# EAGLE design MSP430F2272IDA breakout (EAGLE 5.06)
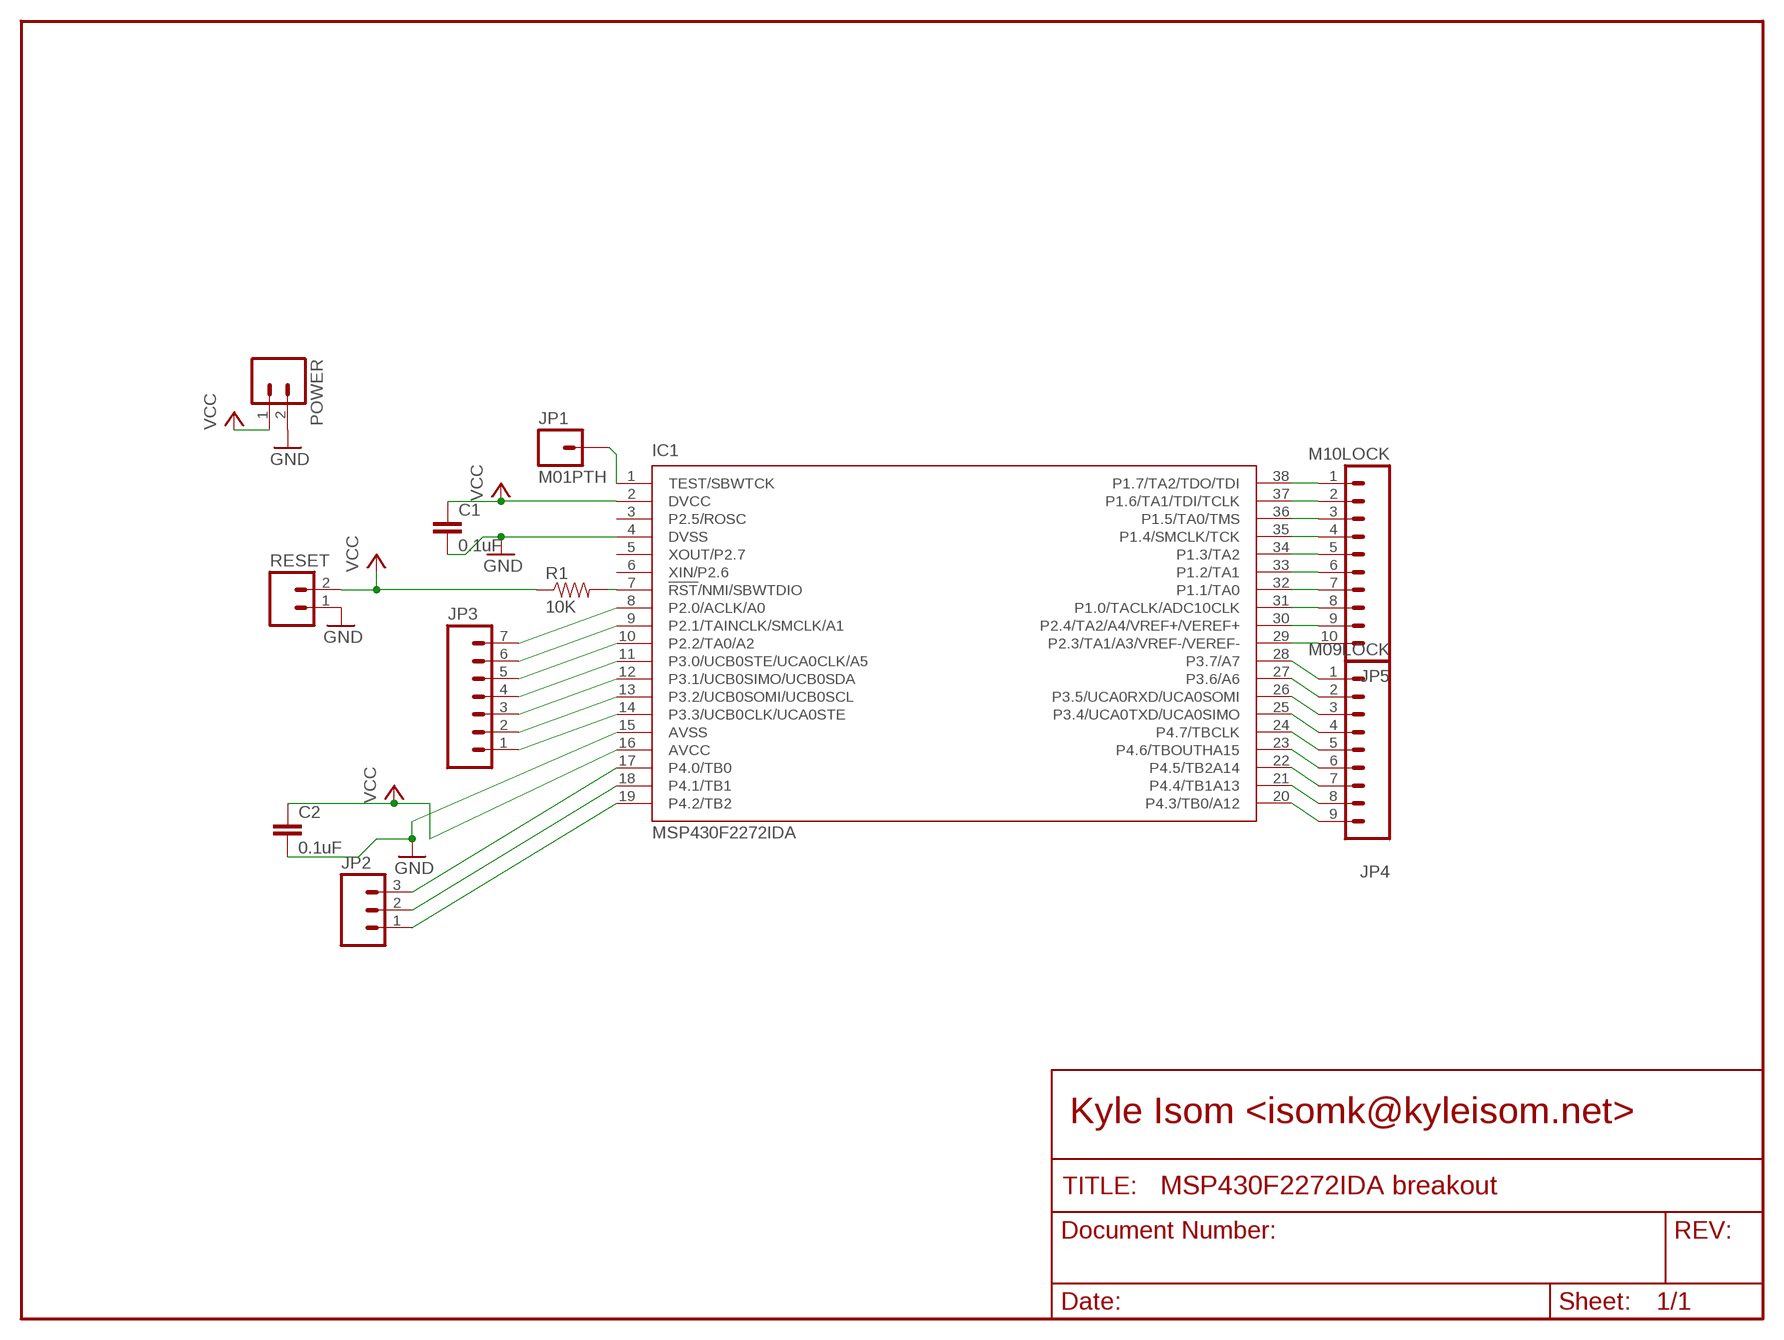
[diagram p0: schematic, sheet 1]

## Parts
C1  0.1uF  CAPPTH1  [CAP-PTH-5MM]
C2  0.1uF  CAPPTH1  [CAP-PTH-5MM]
IC1  MSP430F2272IDA  [TSSOP38_R-PDSO-G38-DA]
JP1  M01PTH  [1X01]
JP2  M03LOCK  [1X03_LOCK]
JP3  M07LOCK  [1X07_LOCK]
JP4  M09LOCK  [1X09_LOCK]
JP5  M10LOCK  [1X10_LOCK]
POWER  M02LOCK  [1X02_LOCK]
R1  10K  RESISTORPTH1  [AXIAL-0.3]
RESET  M02LOCK  [1X02_LOCK]

## Nets
GND: C1.2 C2.2 IC1.4(DVSS) IC1.15(AVSS) POWER.2 RESET.1
N$1: IC1.19(P4.2/TB2) JP2.1
N$2: IC1.18(P4.1/TB1) JP2.2
N$3: IC1.17(P4.0/TB0) JP2.3
N$4: IC1.7(!RST!/NMI/SBWTDIO) R1.P$2
N$5: IC1.14(P3.3/UCB0CLK/UCA0STE) JP3.1
N$6: IC1.13(P3.2/UCB0SOMI/UCB0SCL) JP3.2
N$7: IC1.12(P3.1/UCB0SIMO/UCB0SDA) JP3.3
N$8: IC1.11(P3.0/UCB0STE/UCA0CLK/A5) JP3.4
N$9: IC1.10(P2.2/TA0/A2) JP3.5
N$10: IC1.9(P2.1/TAINCLK/SMCLK/A1) JP3.6
N$11: IC1.8(P2.0/ACLK/A0) JP3.7
N$12: IC1.28(P3.7/A7) JP4.1
N$13: IC1.27(P3.6/A6) JP4.2
N$14: IC1.26(P3.5/UCA0RXD/UCA0SOMI) JP4.3
N$15: IC1.25(P3.4/UCA0TXD/UCA0SIMO) JP4.4
N$16: IC1.24(P4.7/TBCLK) JP4.5
N$17: IC1.23(P4.6/TBOUTHA15) JP4.6
N$18: IC1.22(P4.5/TB2A14) JP4.7
N$19: IC1.21(P4.4/TB1A13) JP4.8
N$20: IC1.20(P4.3/TB0/A12) JP4.9
N$21: IC1.38(P1.7/TA2/TDO/TDI) JP5.1
N$22: IC1.37(P1.6/TA1/TDI/TCLK) JP5.2
N$23: IC1.36(P1.5/TA0/TMS) JP5.3
N$24: IC1.35(P1.4/SMCLK/TCK) JP5.4
N$25: IC1.34(P1.3/TA2) JP5.5
N$26: IC1.33(P1.2/TA1) JP5.6
N$27: IC1.32(P1.1/TA0) JP5.7
N$28: IC1.31(P1.0/TACLK/ADC10CLK) JP5.8
N$29: IC1.30(P2.4/TA2/A4/VREF+/VEREF+) JP5.9
N$30: IC1.29(P2.3/TA1/A3/VREF-/VEREF-) JP5.10
N$31: IC1.1(TEST/SBWTCK) JP1.1
VCC: C1.1 C2.1 IC1.2(DVCC) IC1.16(AVCC) POWER.1 R1.P$1 RESET.2
Unconnected: IC1.3(P2.5/ROSC) IC1.5(XOUT/P2.7) IC1.6(XIN/P2.6)

## Notes on the sheet
- Kyle Isom <isomk@kyleisom.net>

## Library data of the parts
C1 C2 = SparkFun:CAP: Capacitor Standard 0603 ceramic capacitor, and 0.1" leaded capacitor.
IC1 = texas:MSP430F22*2IDA: MIXED SIGNAL MICROCONTROLLER Source: http://focus.ti.com/lit/ds/symlink/msp430f2274.pdf
JP1 = SparkFun:M01: Header 1 Standard 1-pin 0.1" header. Use with straight break away headers (SKU : PRT-00116), right angle break away headers (PRT-00553), swiss pins (PRT-00743), machine pins (PRT-00117), and female headers (PRT-00115).
JP2 = SparkFun:M03: Header 3 Standard 3-pin 0.1" header. Use with straight break away headers (SKU : PRT-00116), right angle break away headers (PRT-00553), swiss pins (PRT-00743), machine pins (PRT-00117), and female headers (PRT-00115). Molex polarized connector foot print use with SKU : PRT-08232 with associated crimp pins and housings.
JP3 = SparkFun:M07: Header 7 Standard 7-pin 0.1" header. Use with straight break away headers (SKU : PRT-00116), right angle break away headers (PRT-00553), swiss pins (PRT-00743), machine pins (PRT-00117), and female headers (PRT-00115). NOTES ON THE VARIANTS LOCK and LOCK_LONGPADS... This footprint was designed to help hold the alignment of a through-hole component (i.e. 7-pin header) while soldering it into place. You may notice that each hole has been shifted either up or down by 0.005 of an inch from it's more standard position (which is usually a perfectly straight line). This slight alteration caused the pins (the squares in the middle) to touch the edges of the holes. Because they are alternating, it causes a "brace" to hold the header in place. 0.005 has proven to be the perfect amount of "off-center" position when using our standard breakaway headers. Although looks a little odd when you look at the bare footprint, once you have a header in there, the alteration is very hard to notice. Also, if you push a header all the way into place, it is covered up entirely on the bottom side. This idea of altering the position of holes to aid alignment will be further integrated into the Sparkfun Library for other footprints. It can help hold any component with 3 or more connection pins.
JP4 = SparkFun:M09: Header 9 Standard 9-pin 0.1" header. Use with straight break away headers (SKU : PRT-00116), right angle break away headers (PRT-00553), swiss pins (PRT-00743), machine pins (PRT-00117), and female headers (PRT-00115).
JP5 = SparkFun:M10: Header 10 Standard 10-pin 0.1" header. Use with straight break away headers (SKU : PRT-00116), right angle break away headers (PRT-00553), swiss pins (PRT-00743), machine pins (PRT-00117), and female headers (PRT-00115).
POWER RESET = SparkFun:M02: Header 2 Standard 2-pin 0.1" header. Use with straight break away headers (SKU : PRT-00116), right angle break away headers (PRT-00553), swiss pins (PRT-00743), machine pins (PRT-00117), and female headers (PRT-00115). Molex polarized connector foot print use with SKU : PRT-08233 with associated crimp pins and housings.
R1 = SparkFun:RESISTOR: Resistor Basic schematic elements and footprints for 0603, 1206, and PTH 1/10th watt (small) resistors.

## Board
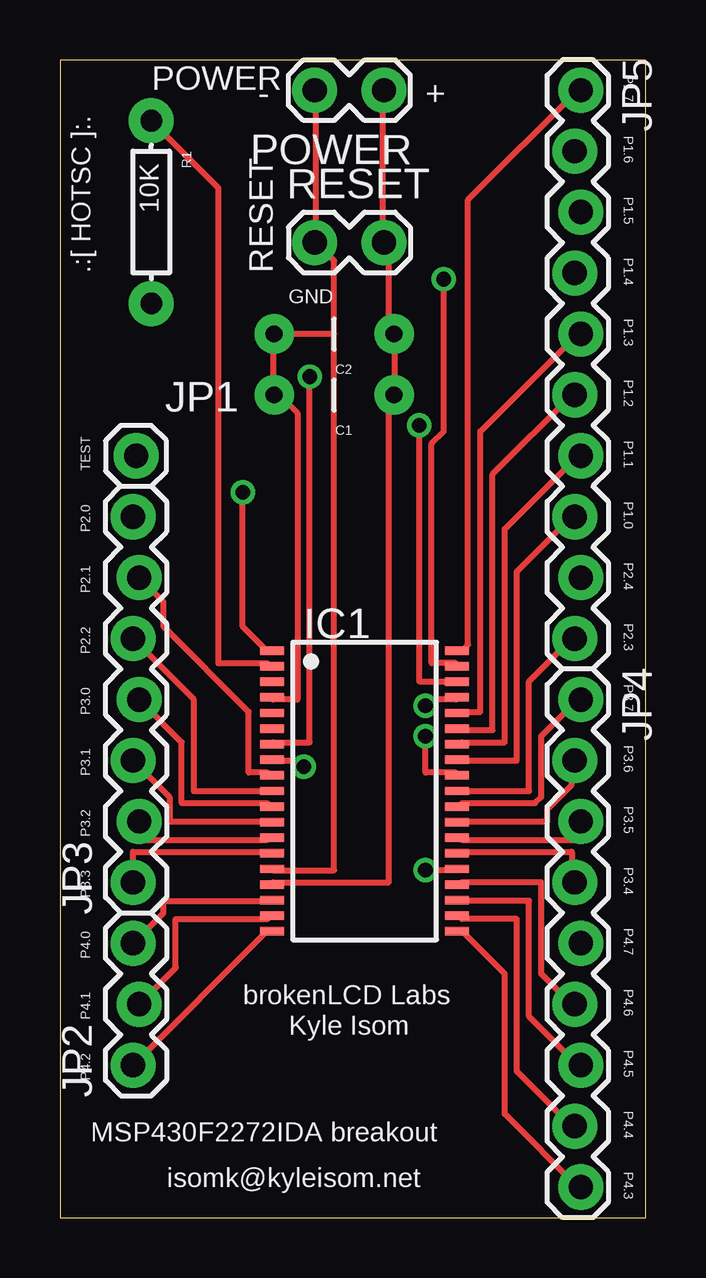
[diagram p1: board, top side]
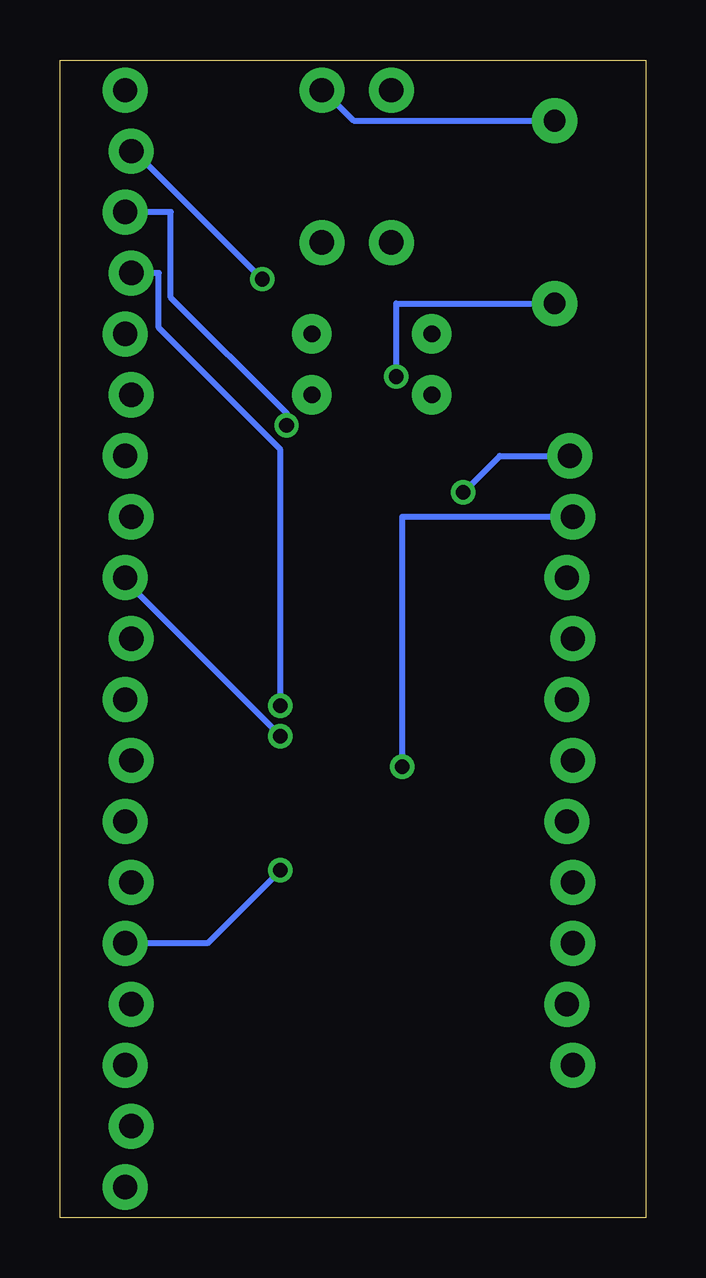
[diagram p2: board, bottom side, seen from below]

Size 24.43 x 48.25 mm. Coordinates in mm from the lower left corner, seen from the top.
Outline: 0,0 24.43,0 24.43,48.25 0,48.25 0,0
Copper layers (1*16): Top 0.035mm / dielectric 1.5mm / Bottom 0.035mm
Design rules "default": minimum track width 10mil, minimum drill 24mil, track to track 8mil, track to pad 8mil, pad to pad 8mil, via to via 8mil, smd to smd 8mil, copper to edge 40mil, drill to drill 8mil, minimum pad ring 10mil, minimum via ring 8mil, stop-mask expansion 4mil, vias tented up to drill 0mil, thermal gap 10mil

### Footprints (pad centres in the part's own frame; a part is rotated, then mirrored left to right if it is on the bottom)
CAP-PTH-5MM = drill 0.7 pad 1.651 round: 1 -2.5,0; 2 2.5,0
TSSOP38_R-PDSO-G38-DA = smd 0.35 x 1: 1 -5.85,-3.85; 2 -5.2,-3.85; 3 -4.55,-3.85; 4 -3.9,-3.85; 5 -3.25,-3.85; 6 -2.6,-3.85; 7 -1.95,-3.85; 8 -1.3,-3.85; 9 -0.65,-3.85; 10 0,-3.85; 11 0.65,-3.85; 12 1.3,-3.85; 13 1.95,-3.85; 14 2.6,-3.85; 15 3.25,-3.85; 16 3.9,-3.85; 17 4.55,-3.85; 18 5.2,-3.85; 19 5.85,-3.85; 20 5.85,3.85; 21 5.2,3.85; 22 4.55,3.85; 23 3.9,3.85; 24 3.25,3.85; 25 2.6,3.85; 26 1.95,3.85; 27 1.3,3.85; 28 0.65,3.85; 29 0,3.85; 30 -0.65,3.85; 31 -1.3,3.85; 32 -1.95,3.85; 33 -2.6,3.85; 34 -3.25,3.85; 35 -3.9,3.85; 36 -4.55,3.85; 37 -5.2,3.85; 38 -5.85,3.85
1X01 = drill 1.016 pad 1.88 round: 1 0,0
1X03_LOCK = drill 1.016 pad 1.88 round: 1 0,0.127; 2 2.54,-0.127; 3 5.08,0.127
1X07_LOCK = drill 1.016 pad 1.88 round: 1 0,0.127; 2 2.54,-0.127; 3 5.08,0.127; 4 7.62,-0.127; 5 10.16,0.127; 6 12.7,-0.127; 7 15.24,0.127
1X09_LOCK = drill 1.016 pad 1.88 round: 1 0,0.127; 2 2.54,-0.127; 3 5.08,0.127; 4 7.62,-0.127; 5 10.16,0.127; 6 12.7,-0.127; 7 15.24,0.127; 8 17.78,-0.127; 9 20.32,0.127
1X10_LOCK = drill 1.016 pad 1.88 round: 1 0,0.127; 2 2.54,-0.127; 3 5.08,0.127; 4 7.62,-0.127; 5 10.16,0.127; 6 12.7,-0.127; 7 15.24,0.127; 8 17.78,-0.127; 9 20.32,0.127; 10 22.86,-0.127
1X02_LOCK = drill 1.016 pad 1.88 round: 1 -0.178,0; 2 2.718,0
AXIAL-0.3 = drill 0.9 pad 1.88 round: P$1 -3.81,0; P$2 3.81,0

### Placement (x,y rotation side)
C1  11.43,34.29 180 top
C2  11.43,36.83 180 top
IC1  12.7,17.78 270 top
JP1  3.17,31.75 0 top
JP2  3.17,6.35 90 top
JP3  3.17,13.97 90 top
JP4  21.59,21.59 270 top
JP5  21.59,46.99 270 top
POWER  13.34,46.99 180 top
R1  3.81,41.91 270 top
RESET  10.79,40.64 0 top

### Tracks (layer width: path | path; a pad name or v marks a point on that pad's centre or on a via)
GND
  Top 0.254: IC1.4 8.89,21.59 9.91,21.59 9.91,33.53 9.14,34.29 C1.2 8.89,34.29 8.89,36.83 C2.2 11.43,36.83 | 11.43,36.83 11.43,39.88 10.67,40.64 | 11.43,36.83 11.43,14.48 8.89,14.48 IC1.15 | 10.67,40.64 10.67,46.99 POWER.2 | 10.67,40.64 RESET.1
N$1
  Top 0.254: JP2.1 8.64,11.94 IC1.19
N$2
  Top 0.254: JP2.2 4.83,10.41 4.83,12.45 8.64,12.45 IC1.18
N$3
  Top 0.254: JP2.3 4.32,12.7 4.32,13.21 8.64,13.21 IC1.17
N$4  (via drill 0.61)
  Top 0.254: v10.41,35.05 10.41,19.81 8.89,19.81 IC1.7
  Bottom 0.254: v10.41,35.05 10.41,38.1 R1.P$2
N$5
  Top 0.254: JP3.1 3.05,15.24 8.64,15.24 IC1.14
N$6
  Top 0.254: JP3.2 3.3,15.75 8.64,15.75 IC1.13
N$7
  Top 0.254: JP3.3 4.57,17.53 4.57,16.51 8.64,16.51 IC1.12
N$8
  Top 0.254: JP3.4 5.08,19.81 5.08,17.27 8.64,17.27 IC1.11
N$9
  Top 0.254: JP3.5 5.59,21.59 5.59,17.78 IC1.10
N$10
  Top 0.254: JP3.6 4.32,25.65 4.32,24.64 7.87,21.08 7.87,18.54 8.64,18.54 IC1.9
N$11  (via drill 0.61)
  Top 0.254: v10.16,18.8 10.16,19.05 8.89,19.05 IC1.8
  Bottom 0.254: v10.16,18.8 10.16,29.21 JP3.7
N$12
  Top 0.254: IC1.28 16.76,17.27 19.81,17.27 20.07,17.53 20.07,20.07 21.59,21.59 JP4.1
N$13
  Top 0.254: IC1.27 16.76,16.51 20.32,16.51 20.32,17.02 21.34,18.03 21.34,19.05 JP4.2
N$14
  Top 0.254: IC1.26 16.76,15.75 21.59,15.75 21.59,16.51 JP4.3
N$15
  Top 0.254: IC1.25 16.76,15.24 21.34,15.24 21.34,13.97 JP4.4
N$16  (via drill 0.61)
  Top 0.254: v15.24,14.48 16.51,14.48 IC1.24
  Bottom 0.254: v15.24,14.48 18.29,11.43 JP4.5
N$17
  Top 0.254: IC1.23 16.76,13.97 20.07,13.97 20.07,10.16 21.34,8.89 JP4.6
N$18
  Top 0.254: IC1.22 16.76,13.21 19.56,13.21 19.56,8.38 21.59,6.35 JP4.7
N$19
  Top 0.254: IC1.21 16.76,12.45 19.05,12.45 19.05,6.1 21.34,3.81 JP4.8
N$20
  Top 0.254: IC1.20 16.76,11.94 18.54,10.16 18.54,4.32 21.59,1.27 JP4.9
N$21
  Top 0.254: IC1.38 16.76,23.62 17.02,23.88 17.02,42.42 21.59,46.99 JP5.1
N$22  (via drill 0.61)
  Top 0.254: v16,39.12 16,32.77 15.49,32.26 15.49,23.11 16.51,23.11 IC1.37
  Bottom 0.254: v16,39.12 21.34,44.45 JP5.2
N$23  (via drill 0.61)
  Top 0.254: v14.99,33.02 14.99,22.35 16.51,22.35 IC1.36
  Bottom 0.254: v14.99,33.02 14.99,33.53 19.81,38.35 19.81,41.91 JP5.3
N$24  (via drill 0.61)
  Top 0.254: v15.24,21.34 15.24,21.59 16.51,21.59 IC1.35
  Bottom 0.254: v15.24,21.34 15.24,32 20.32,37.08 20.32,39.37 JP5.4
N$25
  Top 0.254: IC1.34 16.76,21.08 17.53,21.08 17.53,32.77 21.59,36.83 JP5.5
N$26
  Top 0.254: IC1.33 16.76,20.32 18.03,20.32 18.03,30.99 21.34,34.29 JP5.6
N$27
  Top 0.254: IC1.32 16.76,19.81 18.54,19.81 18.54,28.7 21.59,31.75 JP5.7
N$28
  Top 0.254: IC1.31 16.76,19.05 19.05,19.05 19.05,26.92 21.34,29.21 JP5.8
N$29  (via drill 0.61)
  Top 0.254: v15.24,20.07 15.24,18.54 16.51,18.54 IC1.30
  Bottom 0.254: v15.24,20.07 21.84,26.67 JP5.9
N$30
  Top 0.254: IC1.29 19.56,17.78 19.56,22.35 21.34,24.13 JP5.10
N$31  (via drill 0.61)
  Top 0.254: v7.62,30.23 7.62,24.64 8.64,23.62 IC1.1
  Bottom 0.254: v7.62,30.23 6.1,31.75 JP1.1
VCC
  Top 0.254: R1.P$1 6.6,42.93 6.6,23.11 8.64,23.11 IC1.2 | IC1.16 8.89,13.97 13.72,13.97 13.72,34.29 C1.1 13.97,34.29 13.97,36.83 C2.1 13.72,36.83 13.72,40.64 RESET.2 13.46,40.64 13.46,46.99 POWER.1
  Bottom 0.254: R1.P$1 12.19,45.72 13.46,46.99 POWER.1

### Text on the board
tPlace: P1.7 | POWER | - | + | P1.6 | P1.5 | P1.4 | .:[ HOTSC ]:. | RESET | GND | P1.3 | P1.2 | P1.1 | TEST | P1.0 | P2.0 | P2.4 | P2.1 | P2.3 | P2.2 | P3.7 | P3.0 | P3.6 | P3.1 | P3.5 | P3.2 | P3.4 | P3.3 | P4.7 | P4.0 | P4.6 | brokenLCD Labs | P4.1 | Kyle Isom | P4.5 | P4.2 | P4.4 | MSP430F2272IDA breakout | P4.3 | isomk@kyleisom.net